# EAGLE schematic HuzzahBoard (EAGLE 8.2.1)
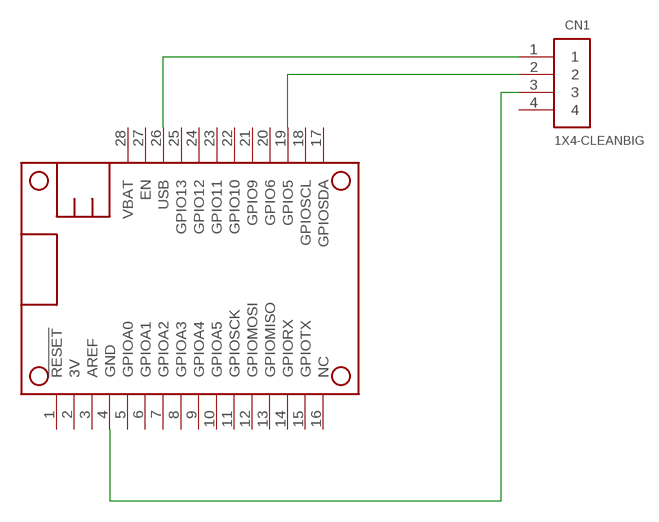
[diagram p0: schematic, sheet 1]

## Parts
CN1  1X4-CLEANBIG  [1X04-CLEANBIG]
MS1  FEATHERWING_NODIM  [FEATHERWING_DIM]

## Nets
N$1: CN1.3 MS1.4(GND)
N$2: CN1.2 MS1.19(GPIO5)
USB: CN1.1 MS1.26(USB)
Unconnected: CN1.4 MS1.1(!RESET) MS1.2(3V) MS1.3(AREF) MS1.5(GPIOA0) MS1.6(GPIOA1) MS1.7(GPIOA2) MS1.8(GPIOA3) MS1.9(GPIOA4) MS1.10(GPIOA5) MS1.11(GPIOSCK) MS1.12(GPIOMOSI) MS1.13(GPIOMISO) MS1.14(GPIORX) MS1.15(GPIOTX) MS1.16(NC) MS1.17(GPIOSDA) MS1.18(GPIOSCL) MS1.20(GPIO6) MS1.21(GPIO9) MS1.22(GPIO10) MS1.23(GPIO11) MS1.24(GPIO12) MS1.25(GPIO13) MS1.27(EN) MS1.28(VBAT)

## Library data of the parts
CN1 = adafruit:1X4: 4-pin connector
MS1 = adafruit:FEATHERWING